# EAGLE design sensorNodev5 (EAGLE 7.2.0)
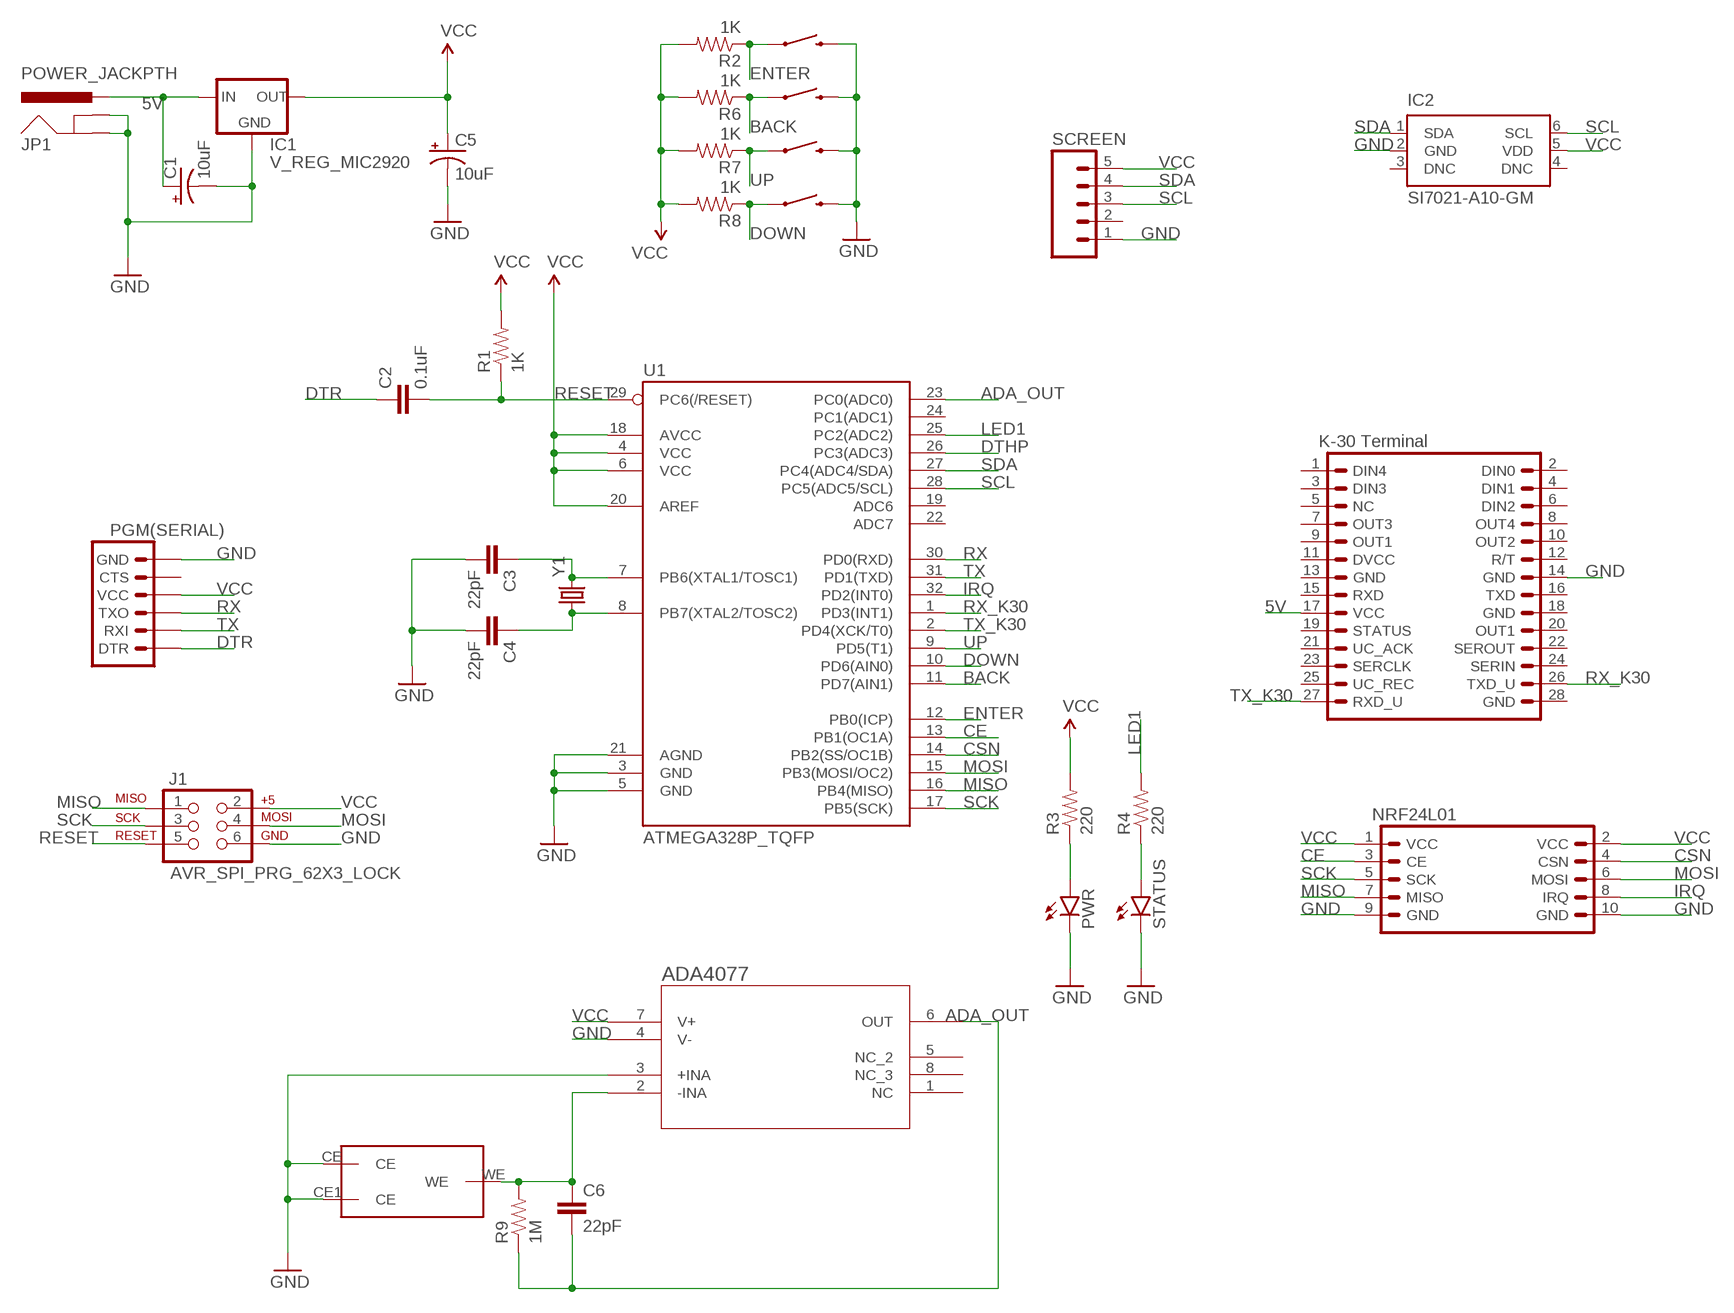
[diagram p0: schematic, sheet 1]

## Parts
BACK  SWITCH-MOMENTARY-2PTH  [TACTILE-PTH]
C1  10uF  CAP_POLPTH2  [CPOL-RADIAL-10UF-25V]
C2  0.1uF  0.1UF-25V(+80/-20%)(0603)  [0603-CAP]
C3  22pF  22PF-50V-5%(0603)  [0603-CAP]
C4  22pF  22PF-50V-5%(0603)  [0603-CAP]
C5  10uF  CAP_POLPTH2  [CPOL-RADIAL-10UF-25V]
C6  22pF  22PF-50V-5%(0603)  [0603-CAP]
DOWN  SWITCH-MOMENTARY-2PTH  [TACTILE-PTH]
ENTER  SWITCH-MOMENTARY-2PTH  [TACTILE-PTH]
IC1  V_REG_MIC2920  [SOT223]
IC2  SI7021-A10-GM  [DFN6-3X3]
J1  AVR_SPI_PRG_62X3_LOCK  [2X3_LOCK]
JP1  POWER_JACKPTH  [POWER_JACK_PTH]
JP3  K-30K-30  [K-30]
PGM(SERIAL)  ARDUINO_SERIAL_PROGRAMPTH  [1X06]
PWR  LED0603  [LED-0603]
R1  1K  1KOHM-1/10W-1%(0603)  [0603-RES]
R2  1K  1KOHM-1/10W-1%(0603)  [0603-RES]
R3  220  1KOHM-1/10W-1%(0603)  [0603-RES]
R4  220  1KOHM-1/10W-1%(0603)  [0603-RES]
R6  1K  1KOHM-1/10W-1%(0603)  [0603-RES]
R7  1K  1KOHM-1/10W-1%(0603)  [0603-RES]
R8  1K  1KOHM-1/10W-1%(0603)  [0603-RES]
R9  1M  1KOHM-1/10W-1%(0603)  [0603-RES]
SCREEN  M05PTH  [1X05]
STATUS  LED0603  [LED-0603]
U1  ATMEGA328P_TQFP  [TQFP32-08]
U2  ADA4077-1ARZ  [R_8]
U$1  TGS5042A  [TGS5042]
U$2  NRF24L01  [NRF24L01]
UP  SWITCH-MOMENTARY-2PTH  [TACTILE-PTH]
Y1  CRYSTALHC49US  [HC49US]

## Nets
5V: C1.1(+) IC1.1(IN) JP1.PWR JP3.17(VCC)
ADA_OUT: C6.2 R9.1 U1.23(PC0(ADC0)) U2.6(OUT)
BACK: BACK.1 R6.1 U1.11(PD7(AIN1))
CE: U1.13(PB1(OC1A)) U$2.3(CE)
CSN: U1.14(PB2(SS/OC1B)) U$2.4(CSN)
DOWN: DOWN.1 R8.1 U1.10(PD6(AIN0))
DTHP: U1.26(PC3(ADC3))
DTR: C2.1 PGM(SERIAL).1(DTR)
ENTER: ENTER.1 R2.1 U1.12(PB0(ICP))
GND: BACK.3 C1.2(-) C3.2 C4.2 C5.2(-) DOWN.3 ENTER.3 IC1.2(GND) IC2.2(GND) J1.6 JP1.GND JP1.GNDBREAK JP3.14(GND) PGM(SERIAL).6(GND) PWR.C SCREEN.1 STATUS.C U1.3(GND) U1.5(GND) U1.21(AGND) U2.3(+INA) U2.4(V-) U$1.CE U$1.CE1(CE) U$2.9(GND) U$2.10(GND) UP.3
IRQ: U1.32(PD2(INT0)) U$2.8(IRQ)
LED1: R4.2 U1.25(PC2(ADC2))
MISO: J1.1 U1.16(PB4(MISO)) U$2.7(MISO)
MOSI: J1.4 U1.15(PB3(MOSI/OC2)) U$2.6(MOSI)
N$1: C3.1 U1.7(PB6(XTAL1/TOSC1)) Y1.2
N$2: C4.1 U1.8(PB7(XTAL2/TOSC2)) Y1.1
N$4: PWR.A R3.1
N$5: R4.1 STATUS.A
N$12: C6.1 R9.2 U2.2(-INA) U$1.WE
RESET: C2.2 J1.5 R1.1 U1.29(PC6(/RESET))
RX: PGM(SERIAL).3(TXO) U1.30(PD0(RXD))
RX_K30: JP3.26(TXD_U) U1.1(PD3(INT1))
SCK: J1.3 U1.17(PB5(SCK)) U$2.5(SCK)
SCL: IC2.6(SCL) SCREEN.3 U1.28(PC5(ADC5/SCL))
SDA: IC2.1(SDA) SCREEN.4 U1.27(PC4(ADC4/SDA))
TX: PGM(SERIAL).2(RXI) U1.31(PD1(TXD))
TX_K30: JP3.27(RXD_U) U1.2(PD4(XCK/T0))
UP: R7.1 U1.9(PD5(T1)) UP.1
VCC: C5.1(+) IC1.3(OUT) IC2.5(VDD) J1.2 PGM(SERIAL).4(VCC) R1.2 R2.2 R3.2 R6.2 R7.2 R8.2 SCREEN.5 U1.4(VCC) U1.6(VCC) U1.18(AVCC) U1.20(AREF) U2.7(V+) U$2.1(VCC) U$2.2(VCC)
Unconnected: IC2.3(DNC) IC2.4(DNC) JP3.1(DIN4) JP3.2(DIN0) JP3.3(DIN3) JP3.4(DIN1) JP3.5(NC) JP3.6(DIN2) JP3.7(OUT3) JP3.8(OUT4) JP3.9(OUT1) JP3.10(OUT2) JP3.11(DVCC) JP3.12(R/T) JP3.13(GND) JP3.15(RXD) JP3.16(TXD) JP3.18(GND) JP3.19(STATUS) JP3.20(OUT1) JP3.21(UC_ACK) JP3.22(SEROUT) JP3.23(SERCLK) JP3.24(SERIN) JP3.25(UC_REC) JP3.28(GND) PGM(SERIAL).5(CTS) SCREEN.2 U1.19(ADC6) U1.22(ADC7) U1.24(PC1(ADC1)) U2.1(NC) U2.5(NC_2) U2.8(NC_3)

## Library data of the parts
BACK DOWN ENTER UP = SparkFun-Electromechanical:SWITCH-MOMENTARY-2: Various NO switches- pushbuttons, reed, etc
C1 C5 = SparkFun-Capacitors:CAP_POL: Capacitor Polarized These are standard SMD and PTH capacitors. Normally 10uF, 47uF, and 100uF in electrolytic and tantalum varieties. Always verify the external diameter of the through hole cap, it varies with capacity, voltage, and manufacturer. The EIA devices should be standard.
C2 = SparkFun-Capacitors:0.1UF-25V(+80/-20%)(0603): CAP-00810 Ceramic Standard decoupling cap; PROD_ID: CAP-00810
C3 C4 C6 = SparkFun-Capacitors:22PF-50V-5%(0603): CAP-07876; PROD_ID: CAP-07876
IC1 = SparkFun-PowerIC:V_REG_MIC2920: MIC2920A (http://www.micrel.com/_PDF/mic2920.pdf) - 400mA output LDO Regulator
IC2 = bespin:SI7021-*: I2C Humidity and Temperature Sensor Source: http://www.silabs.com/Support%20Documents/TechnicalDocs/Si7021.pdf; MF: Silicon Labs; MPN: Si7021-A10-GM; OC_FARNELL: 2422571; OC_NEWARK: 55X3111
J1 = SparkFun-Connectors:AVR_SPI_PRG_6: AVR ISP 6 Pin This is the reduced ISP connector for AVR programming. Common on Arduino. This footprint will take up less PCB space and can be used with a 10-pin to 6-pin adapter such as SKU: BOB-08508 **Special note about "TEST_POINT" package. The stop mask is on the top side, so if you want your programming test points to be on the bottom of your board, make sure to place this package on the bottom side of the board. This also ensure that the orientation to program from the bottom side will be correct.
JP1 = SparkFun-Connectors:POWER_JACK: Power Jack This is the standard 5.5mm barrel jack for power. The PTH is the most common, proven, reliable, footprint. The Slot footprint only works if the mill layer is transmitted to the PCB fab house so be warned. Mating wall wart : TOL-00298 (and others); PROD_ID: CONN-08197
JP3 = bespin:K-30: 0.1" spaced headers
PGM(SERIAL) = SparkFun-Connectors:ARDUINO_SERIAL_PROGRAM: FTDI connector footprints
PWR STATUS = SparkFun-LED:LED: LEDs Standard schematic elements and footprints for 5mm, 3mm, 1206, and 0603 sized LEDs. 5mm - Spark Fun Electronics SKU : COM-00529 (and others)
R1 R2 R6-R8 = SparkFun-Resistors:1KOHM-1/10W-1%(0603): RES-07856; PROD_ID: RES-07856
R3 R4 R9 = SparkFun-Resistors:1KOHM-1/10W-1%(0603): RES-07856; PROD_ID: RES-07856; VALUE: 1K
SCREEN = SparkFun-Connectors:M05: Header 5 Standard 5-pin 0.1" header. Use with straight break away headers (SKU : PRT-00116), right angle break away headers (PRT-00553), swiss pins (PRT-00743), machine pins (PRT-00117), and female headers (PRT-00115). Molex polarized connector foot print use with SKU : PRT-08230 with associated crimp pins and housings.
U1 = SparkFun-DigitalIC:ATMEGA328P_TQFP; PROD_ID: IC-09069
U2 = bespin:ADA4077-1ARZ
U$1 = bespin:TGS5042
U$2 = bespin:NRF24L01
Y1 = SparkFun-FreqCtrl:CRYSTAL: Various standard crystals. Proven footprints.

## Board
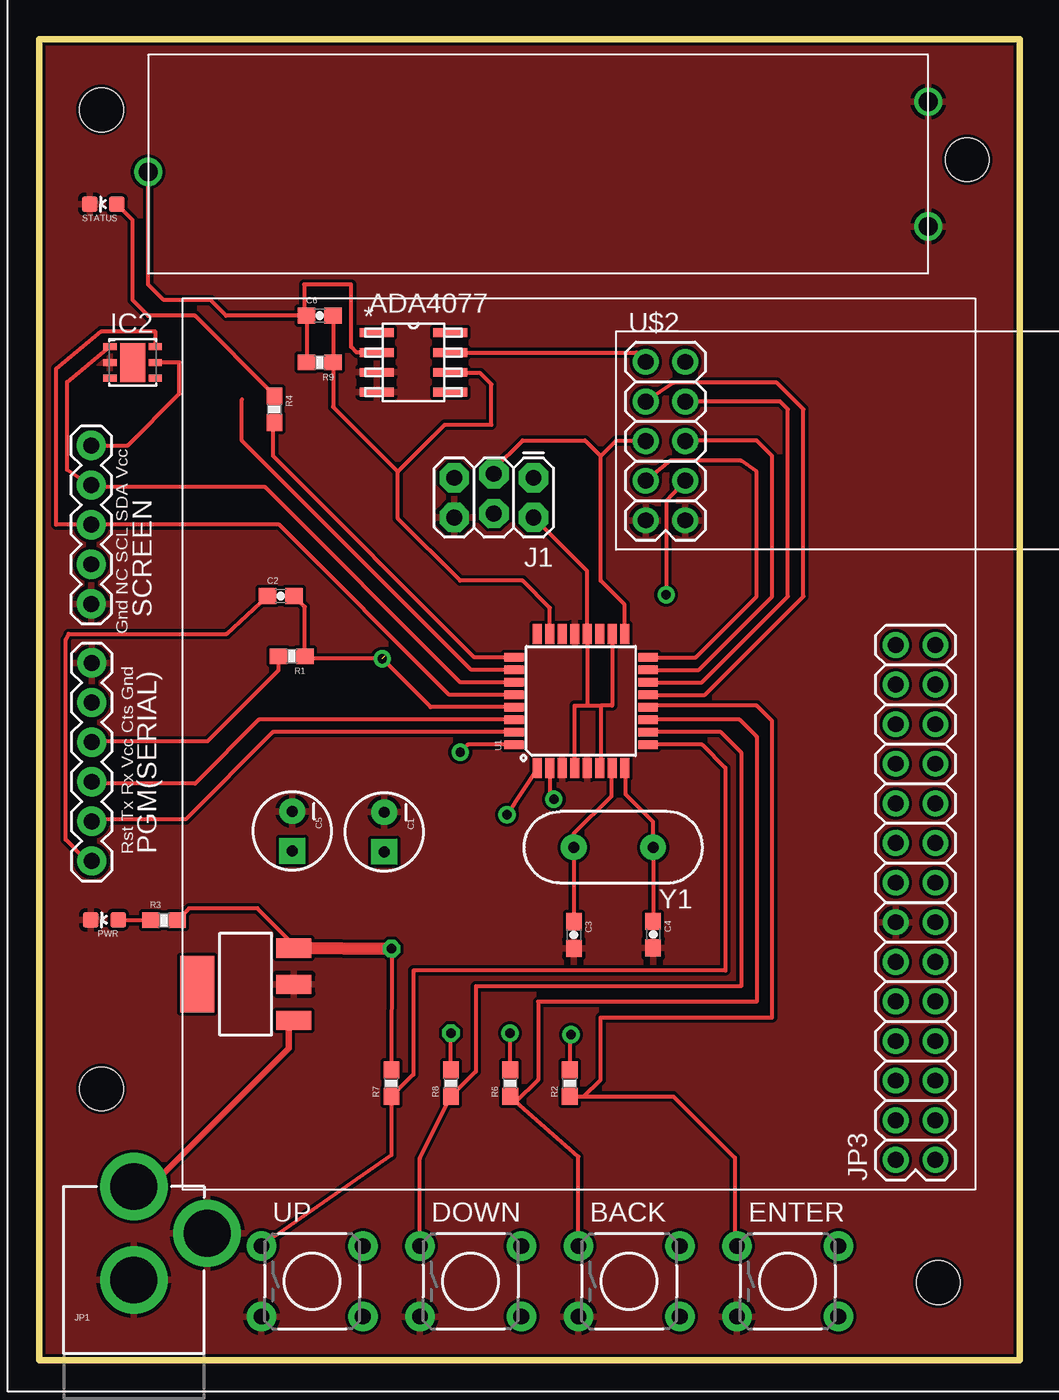
[diagram p1: board, top side]
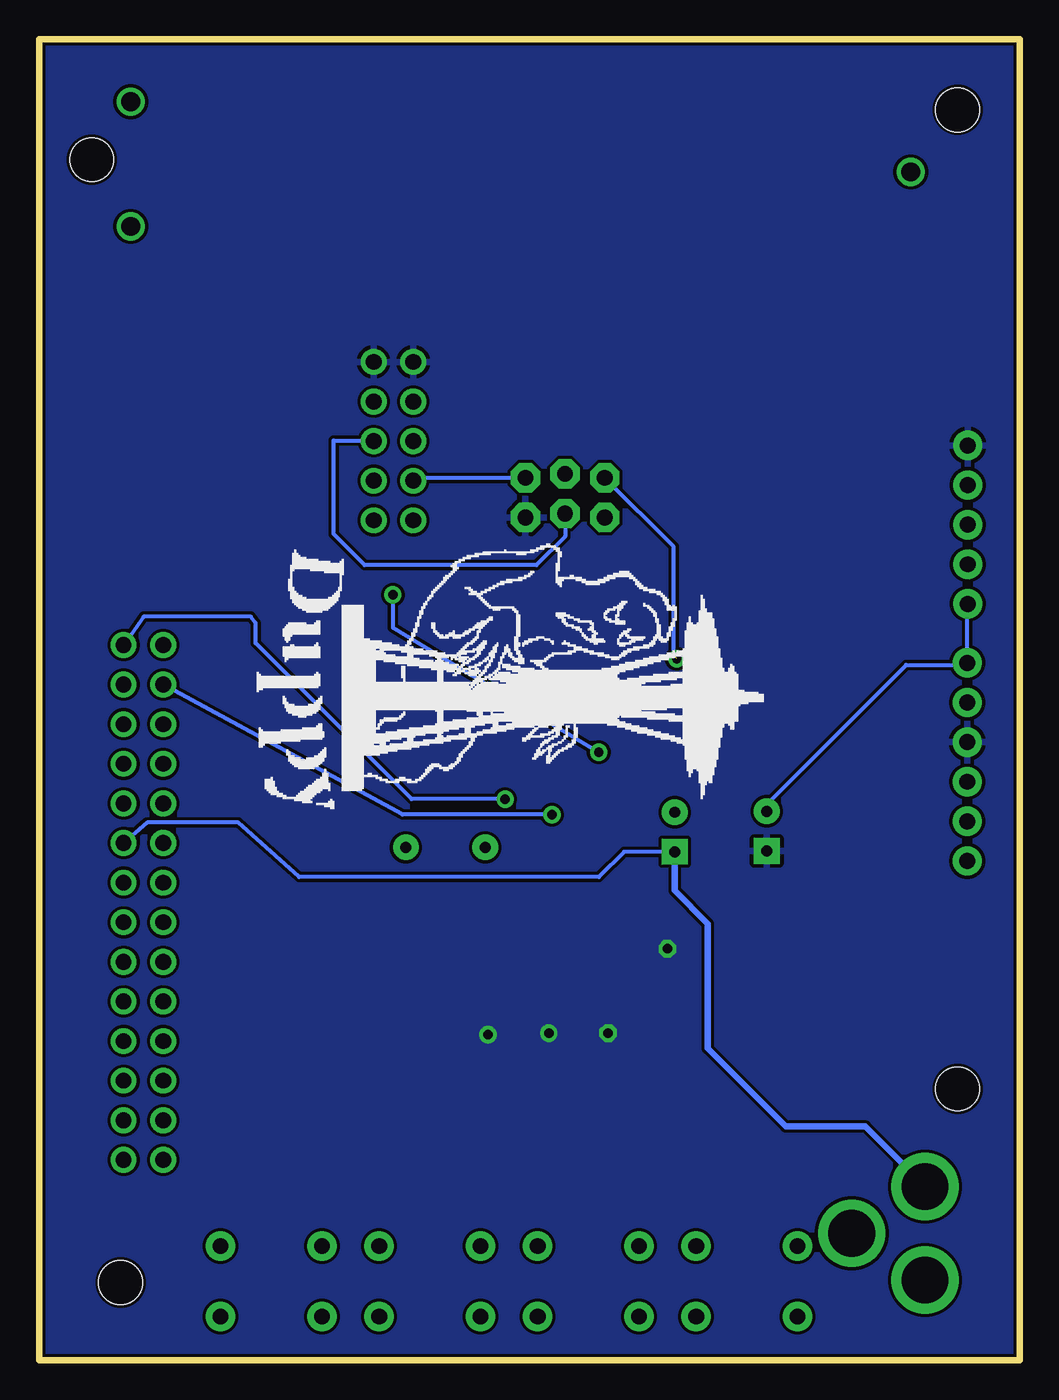
[diagram p2: board, bottom side, seen from below]

Size 62.88 x 84.74 mm. Coordinates in mm from the lower left corner, seen from the top.
Outline: 0,84.74 0,0 62.88,0 62.88,84.74 0,84.74
Copper layers (1*16): Top 0.035mm / dielectric 1.5mm / Bottom 0.035mm
Design rules "SparkFun": minimum track width 8mil, minimum drill 20mil, track to track 8mil, track to pad 8mil, pad to pad 8mil, via to via 8mil, smd to smd 8mil, copper to edge 8mil, drill to drill 8mil, minimum pad ring 12mil, minimum via ring 10mil, stop-mask expansion 4mil, vias tented up to drill 20mil, thermal gap 10mil

### Footprints (pad centres in the part's own frame; a part is rotated, then mirrored left to right if it is on the bottom)
TACTILE-PTH = drill 1.016 pad 1.88: 1 -3.251,2.261; 2 3.251,2.261; 3 -3.251,-2.261; 4 3.251,-2.261
CPOL-RADIAL-10UF-25V = drill 0.7 pad 1.651 square: 1 1.27,0 | drill 0.7 pad 1.651: 2 -1.27,0
0603-CAP = smd 1.1 x 1: 1 -0.85,0; 2 0.85,0
SOT223 = smd 1.219 x 2.235: 1 -2.311,-3.099; 2 0,-3.099; 3 2.311,-3.099 | smd 3.6 x 2.2: 4 0,3.099
DFN6-3X3 = smd 0.85 x 0.45: 1 -1.45,1; 2 -1.45,0; 3 -1.45,-1; 4 1.45,-1; 5 1.45,0; 6 1.45,1 | smd 1.6 x 2.5: EXP 0,0
2X3_LOCK = drill 1.016 pad 1.88 octagon: 1 0,0; 2 0,2.54; 3 2.54,-0.254; 4 2.54,2.286; 5 5.08,0; 6 5.08,2.54
POWER_JACK_PTH = drill 2.997 pad 4.318: GND 0,7.7; GNDBREAK 4.7,10.7; PWR 0,13.7
K-30 = drill 1.016 pad 1.651: 1 1.905,2.54; 2 1.905,5.08; 3 4.445,2.54; 4 4.445,5.08; 5 6.985,2.54; 6 6.985,5.08; 7 9.525,2.54; 8 9.525,5.08; 9 12.065,2.54; 10 12.065,5.08; 11 14.605,2.54; 12 14.605,5.08; 13 17.145,2.54; 14 17.145,5.08; 15 19.685,2.54; 16 19.685,5.08; 17 22.225,2.54; 18 22.225,5.08; 19 24.765,2.54; 20 24.765,5.08; 21 27.305,2.54; 22 27.305,5.08; 23 29.845,2.54; 24 29.845,5.08; 25 32.385,2.54; 26 32.385,5.08; 27 34.925,2.54; 28 34.925,5.08
1X06 = drill 1.016 pad 1.88: 1 0,0; 2 2.54,0; 3 5.08,0; 4 7.62,0; 5 10.16,0; 6 12.7,0
LED-0603 = smd 1 x 1: A 0,-0.877; C 0,0.877
0603-RES = smd 1.1 x 1: 1 -0.85,0; 2 0.85,0
1X05 = drill 1.016 pad 1.88: 1 0,0; 2 2.54,0; 3 5.08,0; 4 7.62,0; 5 10.16,0
TQFP32-08 = smd 1.27 x 0.559: 1 -4.293,2.8; 2 -4.293,2; 3 -4.293,1.2; 4 -4.293,0.4; 5 -4.293,-0.4; 6 -4.293,-1.2; 7 -4.293,-2; 8 -4.293,-2.8; 17 4.293,-2.8; 18 4.293,-2; 19 4.293,-1.2; 20 4.293,-0.4; 21 4.293,0.4; 22 4.293,1.2; 23 4.293,2; 24 4.293,2.8 | smd 0.559 x 1.27: 9 -2.8,-4.293; 10 -2,-4.293; 11 -1.2,-4.293; 12 -0.4,-4.293; 13 0.4,-4.293; 14 1.2,-4.293; 15 2,-4.293; 16 2.8,-4.293; 25 2.8,4.293; 26 2,4.293; 27 1.2,4.293; 28 0.4,4.293; 29 -0.4,4.293; 30 -1.2,4.293; 31 -2,4.293; 32 -2.8,4.293
R_8 = smd 2.184 x 0.559: 1 -2.362,1.905; 2 -2.362,0.635; 3 -2.362,-0.635; 4 -2.362,-1.905; 5 2.362,-1.905; 6 2.362,-0.635; 7 2.362,0.635; 8 2.362,1.905
TGS5042 = drill 1.2: CE 50,3; CE1 50,11; WE 0,6.5
NRF24L01 = drill 1.016 pad 1.651: 1 1.89,12.035; 2 4.43,12.035; 3 1.89,9.495; 4 4.43,9.495; 5 1.89,6.955; 6 4.43,6.955; 7 1.89,4.415; 8 4.43,4.415; 9 1.89,1.875; 10 4.43,1.875
CONTAINER_BOTTOM = hole 2.8: 59.65,7; 61.5,79; 6,82.19; 6,19.415
HC49US = drill 0.7 pad 1.651: 1 -2.54,0; 2 2.54,0

### Placement (x,y rotation side)
BACK  37.83,5.08 0 top
C1  22.13,33.89 270 top
C2  15.5,49.02 0 top
C3  34.28,27.29 270 top
C4  39.36,27.31 270 top
C5  16.23,33.95 270 top
C6  18,67 0 top
DOWN  27.67,5.08 0 top
ENTER  47.99,5.08 0 top
IC1  13.24,24.13 90 top
IC2  6,64 0 top
J1  31.7,56.6 180 top
JP1  6.08,-2.54 0 top
JP3  60,10.96 90 top
PGM(SERIAL)  3.38,32.03 90 top
PWR  4.19,28.26 90 top
R1  16.2,45.16 180 top
R2  34.02,17.78 90 top
R3  8.01,28.23 0 top
R4  15.09,60.99 270 top
R6  30.21,17.78 90 top
R7  22.59,17.78 90 top
R8  26.4,17.78 90 top
R9  18,64 180 top
SCREEN  3.35,48.52 90 top
STATUS  4.12,74.14 90 top
U1  34.74,42.29 90 top
U2  24,64 0 top
U$1  7,69.72 0 top
U$2  37,52 0 top
U$3  [DUPPY_LOGO]  50,55 270 bottom
U$4  [CONTAINER_BOTTOM]  -2,-2 0 top
UP  17.51,5.08 0 top
Y1  36.82,32.91 180 top

### Tracks (layer width: path | path; a pad name or v marks a point on that pad's centre or on a via)
5V
  Top 0.406: JP1.PWR 7.16,11.16 16,20 16,21.48 IC1.1
  Bottom 0.254: C1.1 25.38,32.62 27,31 46.2,31 50.1,34.5 55.94,34.5 JP3.17
  Bottom 0.406: C1.1 22.13,30.13 20,28 20,20 15,15 9.92,15 JP1.PWR
ADA_OUT
  Top 0.254: C6.2 R9.1 18.85,61.15 23,57 | U1.23 32.74,48.26 31,50 27,50 23,54 23,57 | 23,57 26,60 29,60 29,62.6 28.3,63.3 26.43,63.3 U2.6
BACK
  Top 0.254: BACK.1 34.58,13.06 30.57,16.57 | 30.57,16.57 R6.1 | 30.57,16.57 32,18 32,23 46,23 46,40 44.91,41.09 U1.11
CE
  Top 0.254: U1.13 42.69,42.69 49,49 49,61 47.3,62.7 40.7,62.7 U$2.3
CSN
  Top 0.254: U1.14 42.49,43.49 48,49 48,61 47.5,61.5 U$2.4
DOWN
  Top 0.254: DOWN.1 24.42,12.95 R8.1 28,18.53 28,24 45,24 45,39 43.71,40.29 U1.10
DTHP
  Top 0.254: U1.26 27.71,44.29 13,59 13,61.63
DTR
  Top 0.254: PGM(SERIAL).1 3.07,32.03 1.7,33.4 1.7,46.2 1.9,46.6 12.03,46.6 C2.1
ENTER
  Top 0.254: R2.1 34.93,16.93 | 34.93,16.93 36,18 36,22 47,22 47,41 46,42 39.14,42 U1.12 | 34.93,16.93 40.67,16.93 44.6,13 44.6,7.48 ENTER.1
GND
  Bottom 0.254: C5.2 16.23,35.67 7.3,44.6 3.51,44.6 PGM(SERIAL).6 3.38,48.48 SCREEN.1
  pour Top: 0,84.74 0,0 62.88,0 62.88,84.74
IRQ  (via drill 0.6)
  Top 0.254: U$2.8 41.41,56.41 40.2,55.1 v40.2,49.1 | U1.32 27.49,39.49 v27,39
  Bottom 0.254: v40.2,49.1 40.2,47 v27,39
LED1
  Top 0.254: U1.25 27.91,45.09 15,58 15,60.05 R4.2
MISO
  Top 0.254: U1.16 42.09,45.09 46,49 46,57 45,57.7 40.48,57.7 U$2.7
  Bottom 0.254: J1.1 38.7,56.6 U$2.7
MOSI
  Top 0.254: U1.15 42.29,44.29 47,49 47,58 46,59 41.48,59 U$2.6
  Bottom 0.254: J1.4 29.16,52.84 31,51 42,51 44,53 44,59 41.48,59 U$2.6
N$1
  Top 0.254: C3.1 Y1.2 34.28,33.78 36.7,36.2 36.7,37.96 U1.7
N$2
  Top 0.254: C4.1 Y1.1 39.36,34.54 37.6,36.3 37.6,37.94 U1.8
N$4
  Top 0.254: R3.1 5.1,28.23 PWR.A
N$5
  Top 0.254: R4.1 15.09,61.91 10,67 7,67 6,68 6,73.14 STATUS.A
N$12
  Top 0.254: C6.1 R9.2 | C6.1 12,67 11,68 8,68 7,69 U$1.WE 7,76.3 | U2.2 20.36,64.64 20,65 20,69 17,69 17,67.15 C6.1
RESET  (via drill 0.6)  (1 unrouted)
  Top 0.254: U1.29 25.11,41.89 v22,45 17.21,45 R1.1 | 17.09,45.2 R1.1 | R1.1 17.05,48.32 C2.2
  Bottom 0.254: 22.2,45.2 22.2,52.18 J1.5
RX
  Top 0.254: U1.30 14.09,41.09 10,37 3.49,37 PGM(SERIAL).3
RX_K30  (via drill 0.6)
  Top 0.254: U1.1 31.94,37.94 v30,35
  Bottom 0.254: v30,35 39.58,35 JP3.26
SCK
  Top 0.254: U1.17 37.54,48.46 36,50 36,58 | 36,58 37,59 38.84,59 U$2.5 | J1.3 29.16,57.16 31,59 35,59 36,58
SCL
  Top 0.254: U1.28 26.31,42.69 15.4,53.6 SCREEN.3 | SCREEN.3 | SCREEN.3 1.1,53.6 1.1,63.6 4,66 7.45,66 IC2.6
SDA
  Top 0.254: U1.27 27.01,43.49 14.5,56 3.48,56 SCREEN.4 3.26,56.14 1.8,57.1 1.8,62.75 IC2.1
TX
  Top 0.254: U1.31 14.99,40.29 9.4,34.7 3.51,34.7 PGM(SERIAL).2
TX_K30  (via drill 0.6)
  Top 0.254: U1.2 32.74,36.26 v33,36
  Bottom 0.254: v33,36 39,36 49,46 49,47.3 49.3,47.7 56.18,47.7 JP3.27
UP
  Top 0.254: UP.1 22.59,13.17 R7.1 24,18.34 24,25 44,25 44,38 42.51,39.49 U1.9
VCC  (via drill 0.6, 0.6 pad 0.81)
  Top 0.254: R1.2 15.35,44.25 10.8,39.7 3.43,39.7 PGM(SERIAL).4 | U1.4 34.34,42 35.14,42 | 35.14,42 36,42 | 36,42 36,38 U1.6 | 35.14,42 U1.20 35.14,50.62 J1.2 | U1.18 36.74,42 36,42 | IC1.3 16.34,26.66 14,29 9.63,29 R3.2 | R6.2 v30.2,21 | R2.2 v34.1,20.9 | v22.6,26.4 R7.2 | R8.2 v26.4,21 | 38.89,64.64 U$2.1 38.29,64.64 U2.7 | SCREEN.5 5.68,58.68 9,62 9,64 IC2.5
  Top 0.813: IC1.3 v22.6,26.4
  pour Bottom: 0,84.74 62.88,84.74 62.88,0 0,0

### Text on the board
tNames: Gnd NC SCL SDA Vcc | Rst Tx Rx Vcc Cts Gnd